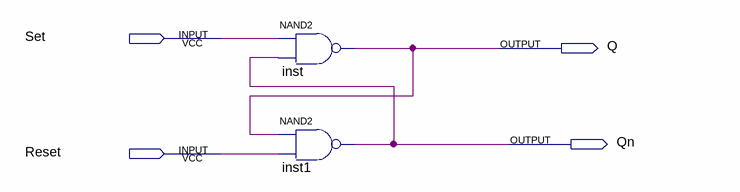
[diagram p0: schematic sheet]
// Quartus schematic SR_Latch.bdf as structural Verilog: 2 symbols, 4 pins
module SR_Latch (
  input  Set,
  input  Reset,
  output Q,
  output Qn
);

  nand inst (Q, Set, Qn);
  nand inst1 (Qn, Q, Reset);
endmodule
